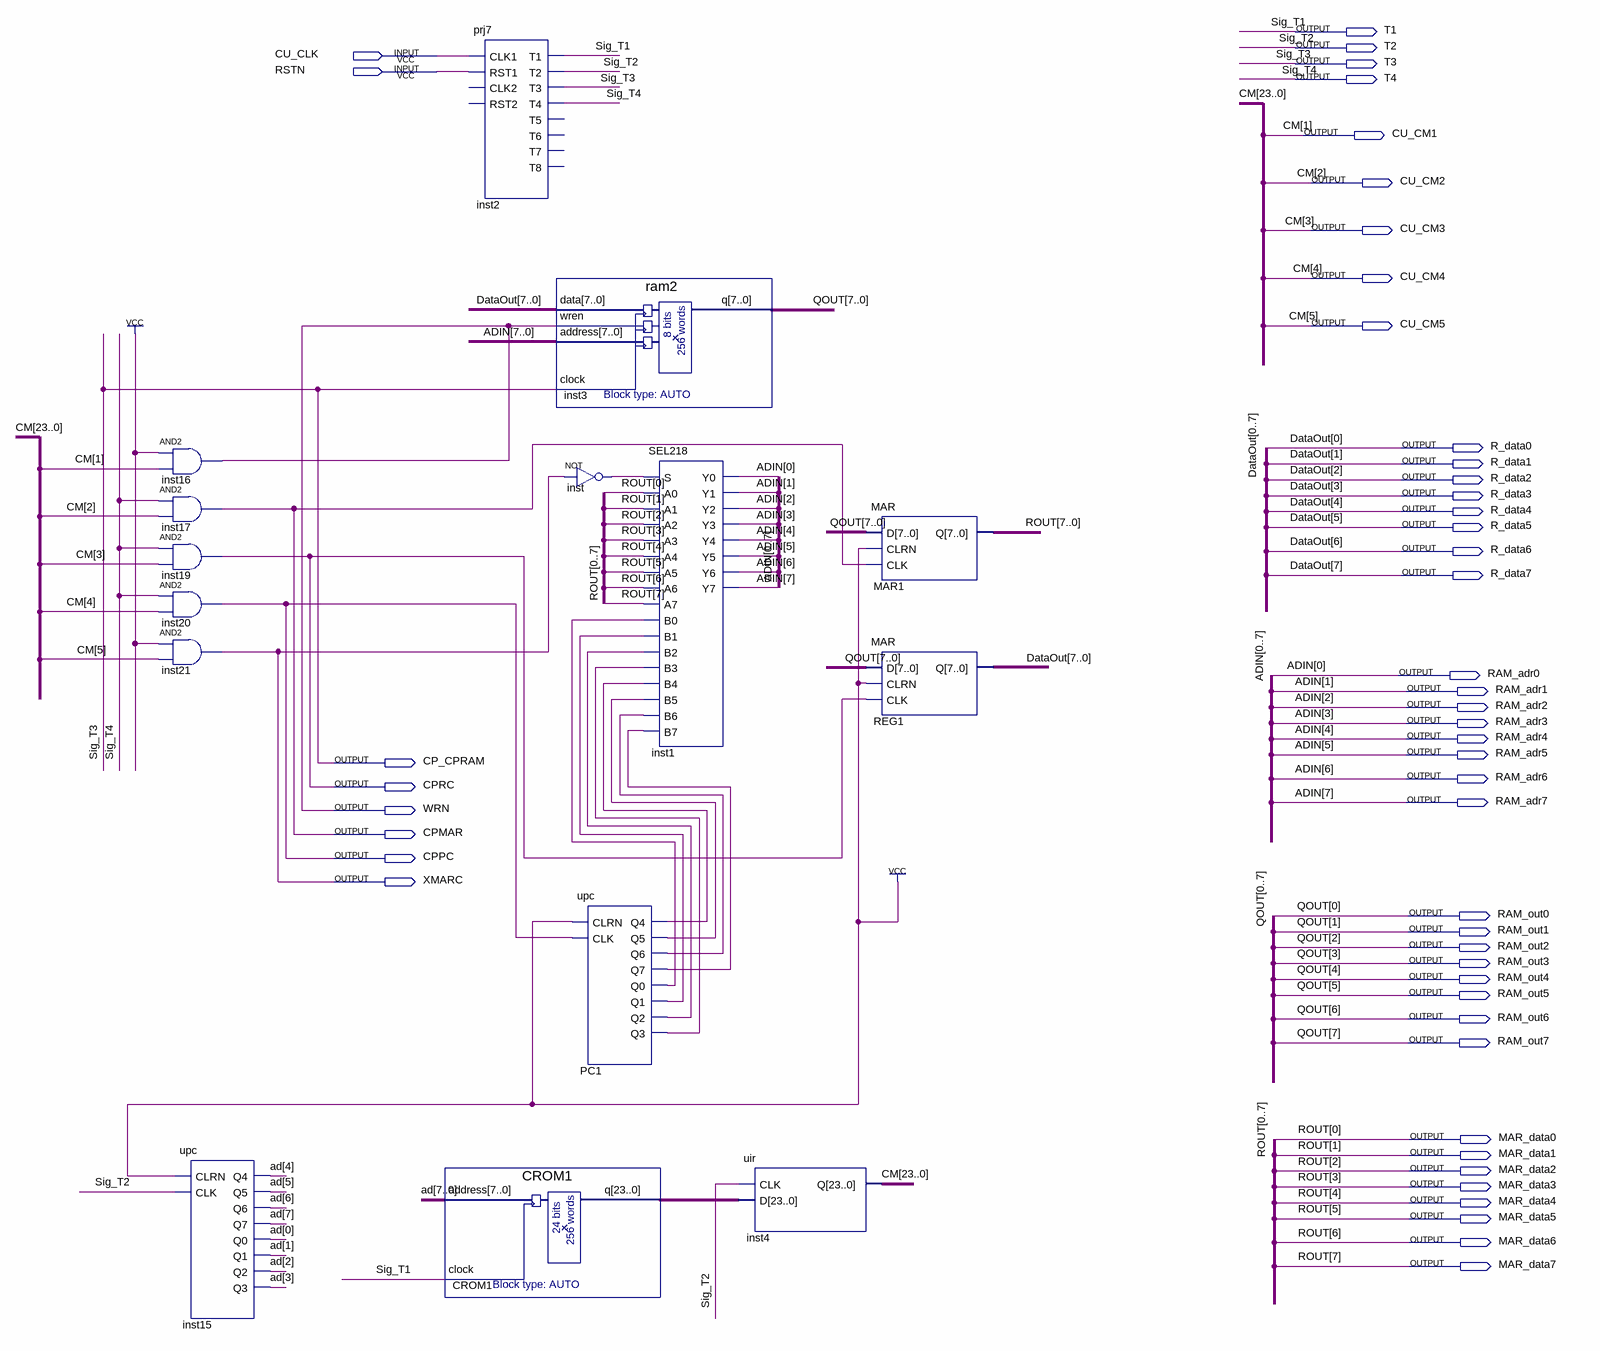
[diagram p0: schematic sheet]
// Quartus schematic proj2_multi.bdf as structural Verilog: 15 symbols, 49 pins
module proj2_multi (
  input  CU_CLK,
  input  RSTN,
  output T1,
  output T2,
  output T3,
  output T4,
  output CU_CM1,
  output CU_CM2,
  output CU_CM3,
  output CU_CM4,
  output CU_CM5,
  output R_data0,
  output R_data1,
  output R_data2,
  output R_data3,
  output R_data4,
  output R_data5,
  output R_data6,
  output R_data7,
  output RAM_adr0,
  output RAM_adr1,
  output RAM_adr2,
  output RAM_adr3,
  output RAM_adr4,
  output RAM_adr5,
  output CP_CPRAM,
  output RAM_adr6,
  output CPRC,
  output RAM_adr7,
  output WRN,
  output CPMAR,
  output CPPC,
  output XMARC,
  output RAM_out0,
  output RAM_out1,
  output RAM_out2,
  output RAM_out3,
  output RAM_out4,
  output RAM_out5,
  output RAM_out6,
  output RAM_out7,
  output MAR_data0,
  output MAR_data1,
  output MAR_data2,
  output MAR_data3,
  output MAR_data4,
  output MAR_data5,
  output MAR_data6,
  output MAR_data7
);

  wire inst_out, PC1_q0, PC1_q1, PC1_q2, PC1_q3, PC1_q4, PC1_q5, PC1_q6, PC1_q7;
  wire [7:0] ad;
  wire [23:0] CM, CROM1_q;

  and inst16 (WRN, 1'b1, CU_CM1);
  and inst17 (CPMAR, T4, CU_CM2);
  and inst19 (CPRC, T4, CU_CM3);
  and inst20 (CPPC, T4, CU_CM4);
  and inst21 (XMARC, 1'b1, CU_CM5);
  upc inst15 (
    .CLRN(1'b1), .CLK(T2), .Q4(ad[4]), .Q5(ad[5]), .Q6(ad[6]), .Q7(ad[7]), .Q0(ad[0]), .Q1(ad[1]),
    .Q2(ad[2]), .Q3(ad[3]));
  prj7 inst2 (
    .CLK1(CU_CLK), .RST1(RSTN), .T1(T1), .T2(T2), .T3(CP_CPRAM), .T4(T4));  // open: CLK2, RST2, T5, T6, T7, T8
  CROM1 CROM1 (.address(ad), .clock(T1), .q(CROM1_q));
  ram2 inst3 (
    .data({R_data7, R_data6, R_data5, R_data4, R_data3, R_data2, R_data1, R_data0}), .wren(WRN),
    .address({RAM_adr7, RAM_adr6, RAM_adr5, RAM_adr4, RAM_adr3, RAM_adr2, RAM_adr1, RAM_adr0}),
    .clock(CP_CPRAM), .q({RAM_out7, RAM_out6, RAM_out5, RAM_out4, RAM_out3, RAM_out2, RAM_out1, RAM_out0}));
  not inst (inst_out, XMARC);
  upc PC1 (
    .CLRN(1'b1), .CLK(CPPC), .Q4(PC1_q4), .Q5(PC1_q5), .Q6(PC1_q6), .Q7(PC1_q7), .Q0(PC1_q0), .Q1(PC1_q1),
    .Q2(PC1_q2), .Q3(PC1_q3));
  SEL218 inst1 (
    .S(inst_out), .A0(MAR_data0), .A1(MAR_data1), .A2(MAR_data2), .A3(MAR_data3), .A4(MAR_data4),
    .A5(MAR_data5), .A6(MAR_data6), .A7(MAR_data7), .B0(PC1_q0), .B1(PC1_q1), .B2(PC1_q2), .B3(PC1_q3),
    .B4(PC1_q4), .B5(PC1_q5), .B6(PC1_q6), .B7(PC1_q7), .Y0(RAM_adr0), .Y1(RAM_adr1), .Y2(RAM_adr2),
    .Y3(RAM_adr3), .Y4(RAM_adr4), .Y5(RAM_adr5), .Y6(RAM_adr6), .Y7(RAM_adr7));
  uir inst4 (.CLK(T2), .D(CROM1_q), .Q({CM[23:6], CU_CM5, CU_CM4, CU_CM3, CU_CM2, CU_CM1, CM[0]}));
  MAR MAR1 (
    .D({RAM_out7, RAM_out6, RAM_out5, RAM_out4, RAM_out3, RAM_out2, RAM_out1, RAM_out0}), .CLRN(1'b1),
    .CLK(CPMAR), .Q({MAR_data7, MAR_data6, MAR_data5, MAR_data4, MAR_data3, MAR_data2, MAR_data1, MAR_data0}));
  MAR REG1 (
    .D({RAM_out7, RAM_out6, RAM_out5, RAM_out4, RAM_out3, RAM_out2, RAM_out1, RAM_out0}), .CLRN(1'b1),
    .CLK(CPRC), .Q({R_data7, R_data6, R_data5, R_data4, R_data3, R_data2, R_data1, R_data0}));

  assign T3 = CP_CPRAM;

  // Other names for the same wires on the sheet: ADIN[7:0] = {RAM_adr7, RAM_adr6, RAM_adr5, RAM_adr4, RAM_adr3, RAM_adr2, RAM_adr1, RAM_adr0};
  //   CM[5:1] = {CU_CM5, CU_CM4, CU_CM3, CU_CM2, CU_CM1};
  //   DataOut[7:0] = {R_data7, R_data6, R_data5, R_data4, R_data3, R_data2, R_data1, R_data0};
  //   QOUT[7:0] = {RAM_out7, RAM_out6, RAM_out5, RAM_out4, RAM_out3, RAM_out2, RAM_out1, RAM_out0};
  //   ROUT[7:0] = {MAR_data7, MAR_data6, MAR_data5, MAR_data4, MAR_data3, MAR_data2, MAR_data1, MAR_data0};
  //   Sig_T1 = T1; Sig_T2 = T2; Sig_T3 = CP_CPRAM; Sig_T4 = T4
endmodule
